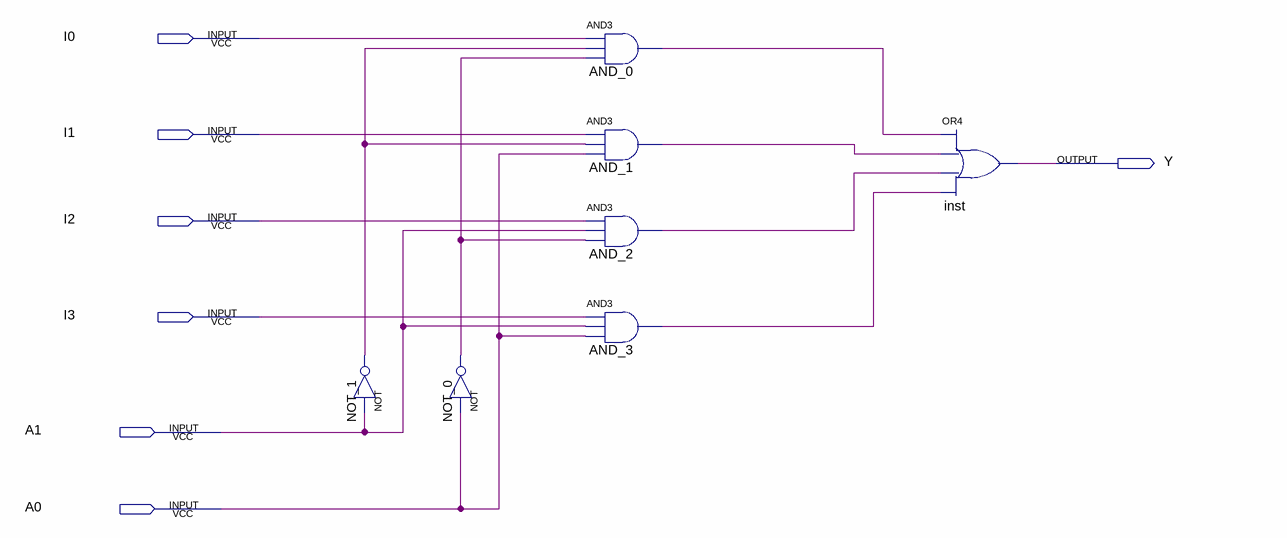
[diagram p0: schematic sheet]
// Quartus schematic mux_4_1.bdf as structural Verilog: 7 symbols, 7 pins
module mux_4_1 (
  input  I0,
  input  I1,
  input  I2,
  input  I3,
  input  A1,
  input  A0,
  output Y
);

  wire AND_0_out, AND_1_out, AND_2_out, AND_3_out, NOT_0_out, NOT_1_out;

  not NOT_1 (NOT_1_out, A1);
  not NOT_0 (NOT_0_out, A0);
  and AND_0 (AND_0_out, I0, NOT_1_out, NOT_0_out);
  and AND_1 (AND_1_out, I1, NOT_1_out, A0);
  and AND_2 (AND_2_out, I2, A1, NOT_0_out);
  and AND_3 (AND_3_out, I3, A1, A0);
  or inst (Y, AND_0_out, AND_1_out, AND_2_out, AND_3_out);
endmodule
